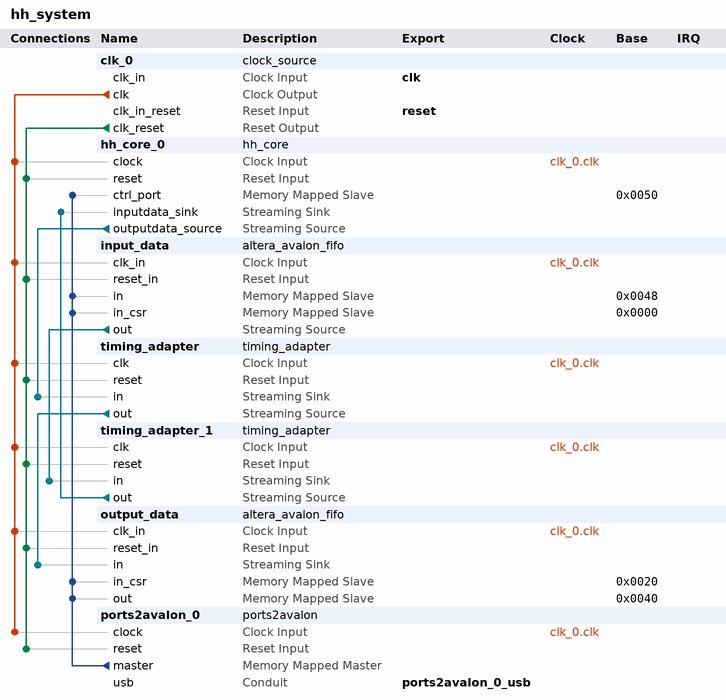
[diagram p0: system contents]
# Platform Designer (Qsys) system hh_system
# Parameters at their usual value, and those the tool derives, are not listed.
package require -exact qsys 11.1
create_system hh_system
set_project_property DEVICE_FAMILY STRATIXIV

add_instance clk_0 clock_source 11.1
set_instance_parameter_value clk_0 clockFrequency 50000000

add_instance hh_core_0 hh_core 1.0

add_instance input_data altera_avalon_fifo 11.1
set_instance_parameter_value input_data bitsPerSymbol 32
set_instance_parameter_value input_data channelWidth 0
set_instance_parameter_value input_data errorWidth 0
set_instance_parameter_value input_data fifoDepth 8192
set_instance_parameter_value input_data fifoInputInterfaceOptions AVALONMM_WRITE
set_instance_parameter_value input_data fifoOutputInterfaceOptions AVALONST_SOURCE
set_instance_parameter_value input_data singleClockMode true
set_instance_parameter_value input_data symbolsPerBeat 1
set_instance_parameter_value input_data useIRQ false
set_instance_parameter_value input_data usePacket false
set_instance_parameter_value input_data useReadControl false

add_instance timing_adapter timing_adapter 11.1
set_instance_parameter_value timing_adapter inBitsPerSymbol 32
set_instance_parameter_value timing_adapter inChannelWidth 0
set_instance_parameter_value timing_adapter inErrorWidth 0
set_instance_parameter_value timing_adapter inMaxChannel 0
set_instance_parameter_value timing_adapter inReadyLatency 0
set_instance_parameter_value timing_adapter inSymbolsPerBeat 1
set_instance_parameter_value timing_adapter inUseEmptyPort NO
set_instance_parameter_value timing_adapter inUsePackets false
set_instance_parameter_value timing_adapter inUseReady true
set_instance_parameter_value timing_adapter inUseValid true
set_instance_parameter_value timing_adapter outReadyLatency 1
set_instance_parameter_value timing_adapter outUseReady true
set_instance_parameter_value timing_adapter outUseValid true

add_instance timing_adapter_1 timing_adapter 11.1
set_instance_parameter_value timing_adapter_1 inBitsPerSymbol 32
set_instance_parameter_value timing_adapter_1 inChannelWidth 0
set_instance_parameter_value timing_adapter_1 inErrorWidth 0
set_instance_parameter_value timing_adapter_1 inMaxChannel 0
set_instance_parameter_value timing_adapter_1 inReadyLatency 1
set_instance_parameter_value timing_adapter_1 inSymbolsPerBeat 1
set_instance_parameter_value timing_adapter_1 inUseEmptyPort NO
set_instance_parameter_value timing_adapter_1 inUsePackets false
set_instance_parameter_value timing_adapter_1 inUseReady true
set_instance_parameter_value timing_adapter_1 inUseValid true
set_instance_parameter_value timing_adapter_1 outReadyLatency 0
set_instance_parameter_value timing_adapter_1 outUseReady true
set_instance_parameter_value timing_adapter_1 outUseValid true

add_instance output_data altera_avalon_fifo 11.1
set_instance_parameter_value output_data bitsPerSymbol 32
set_instance_parameter_value output_data channelWidth 0
set_instance_parameter_value output_data errorWidth 0
set_instance_parameter_value output_data fifoDepth 8192
set_instance_parameter_value output_data fifoInputInterfaceOptions AVALONST_SINK
set_instance_parameter_value output_data fifoOutputInterfaceOptions AVALONMM_READ
set_instance_parameter_value output_data singleClockMode true
set_instance_parameter_value output_data symbolsPerBeat 1
set_instance_parameter_value output_data useIRQ true
set_instance_parameter_value output_data usePacket false
set_instance_parameter_value output_data useReadControl false

add_instance ports2avalon_0 ports2avalon 1.0
set_instance_parameter_value ports2avalon_0 ADDRESS_WIDTH 32

# connections
add_connection clk_0.clk hh_core_0.clock clock
add_connection clk_0.clk input_data.clk_in clock
add_connection clk_0.clk output_data.clk_in clock
add_connection clk_0.clk ports2avalon_0.clock clock
add_connection clk_0.clk timing_adapter.clk clock
add_connection clk_0.clk timing_adapter_1.clk clock
add_connection clk_0.clk_reset hh_core_0.reset reset
add_connection clk_0.clk_reset input_data.reset_in reset
add_connection clk_0.clk_reset output_data.reset_in reset
add_connection clk_0.clk_reset ports2avalon_0.reset reset
add_connection clk_0.clk_reset timing_adapter.reset reset
add_connection clk_0.clk_reset timing_adapter_1.reset reset
add_connection ports2avalon_0.master hh_core_0.ctrl_port avalon
set_connection_parameter_value ports2avalon_0.master/hh_core_0.ctrl_port baseAddress 0x0050
add_connection ports2avalon_0.master input_data.in avalon
set_connection_parameter_value ports2avalon_0.master/input_data.in baseAddress 0x0048
add_connection ports2avalon_0.master input_data.in_csr avalon
set_connection_parameter_value ports2avalon_0.master/input_data.in_csr baseAddress 0x0000
add_connection ports2avalon_0.master output_data.in_csr avalon
set_connection_parameter_value ports2avalon_0.master/output_data.in_csr baseAddress 0x0020
add_connection ports2avalon_0.master output_data.out avalon
set_connection_parameter_value ports2avalon_0.master/output_data.out baseAddress 0x0040
add_connection hh_core_0.outputdata_source timing_adapter.in avalon_streaming
add_connection input_data.out timing_adapter_1.in avalon_streaming
add_connection timing_adapter.out output_data.in avalon_streaming
add_connection timing_adapter_1.out hh_core_0.inputdata_sink avalon_streaming

# exported interfaces
add_interface clk clock sink
set_interface_property clk EXPORT_OF clk_0.clk_in
add_interface reset reset sink
set_interface_property reset EXPORT_OF clk_0.clk_in_reset
add_interface ports2avalon_0_usb conduit end
set_interface_property ports2avalon_0_usb EXPORT_OF ports2avalon_0.usb

save_system hh_system.qsys
